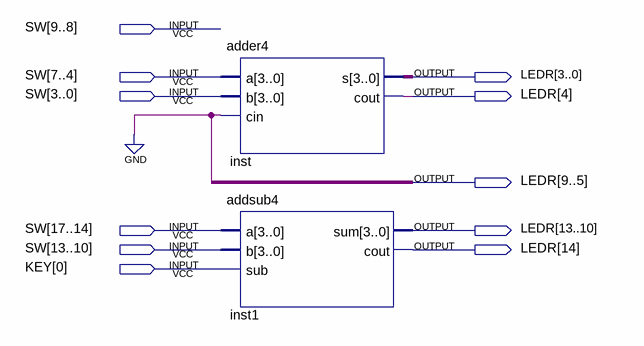
[diagram p0: schematic sheet]
// Quartus schematic AdderDemo.bdf as structural Verilog: 2 symbols, 11 pins
module AdderDemo (
  input  [17:0] SW,
  input  [0:0] KEY,
  output [14:0] LEDR
);

  adder4 inst (.a(SW[7:4]), .b(SW[3:0]), .cin(1'b0), .s(LEDR[3:0]), .cout(LEDR[4]));
  addsub4 inst1 (.a(SW[17:14]), .b(SW[13:10]), .sub(KEY[0]), .sum(LEDR[13:10]), .cout(LEDR[14]));
endmodule
